# Altium schematic sheet MCU.SchDoc
size A4; SheetNumber: 2; SheetTotal: 4
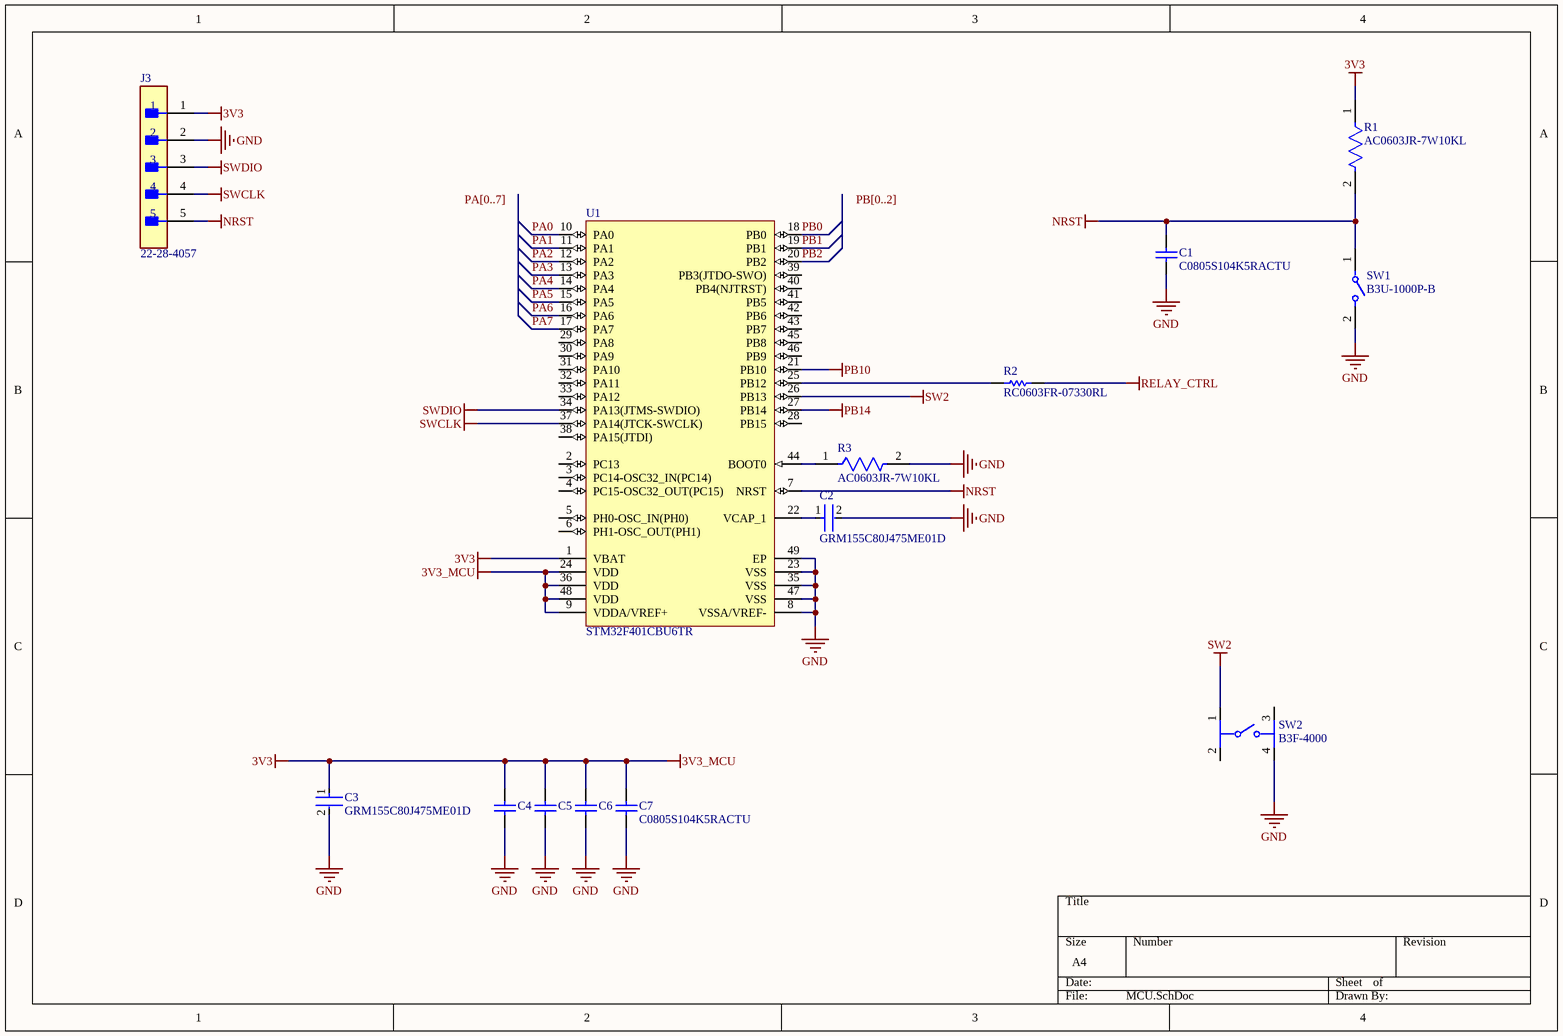
[diagram p0: MCU.SchDoc]

## Parts
C1  C0805S104K5RACTU  [CAPC2013X145X50NL20T25]
C2  GRM155C80J475ME01D  [FP-GRM155-0_2-MFG]
C3  GRM155C80J475ME01D  [FP-GRM155-0_2-MFG]
C4  C0805S104K5RACTU  [CAPC2013X145X50NL20T25]  (value not drawn)
C5  C0805S104K5RACTU  [CAPC2013X145X50NL20T25]  (value not drawn)
C6  C0805S104K5RACTU  [CAPC2013X145X50NL20T25]  (value not drawn)
C7  C0805S104K5RACTU  [CAPC2013X145X50NL20T25]
J3  22-28-4057  [FP-22-28-4057-MFG]
R1  AC0603JR-7W10KL  [FP-AC0603-IPC_A]
R2  RC0603FR-07330RL  [RESC1608X55X25NL10T15]
R3  AC0603JR-7W10KL  [FP-AC0603-IPC_A]
SW1  B3U-1000P-B  [FP-B3U-1000P-B-MFG]
SW2  B3F-4000  [FP-B3F-4000-MFG]
U1  STM32F401CBU6TR  [STM-UFQFPN48_L]

## Nets
3V3: C3.1 C4.2 C5.2 C6.2 C7.2 J3.1 R1.1 U1.1(VBAT) U1.9(VDDA/VREF+) U1.24(VDD) U1.36(VDD) U1.48(VDD)  [also labelled 3V3_MCU]
GND: C1.1 C2.2 C3.2 C4.1 C5.1 C6.1 C7.1 J3.2 R3.2 SW1.2 SW2.4 U1.8(VSSA/VREF-) U1.23(VSS) U1.35(VSS) U1.47(VSS) U1.49(EP)
NRST: C1.2 J3.5 R1.2 SW1.1 U1.7(NRST)
PB10: U1.21(PB10)
PB14: U1.27(PB14)
RELAY_CTRL: R2.2
SW2: SW2.1 U1.26(PB13)
SWCLK: J3.4 U1.37(PA14(JTCK-SWCLK))
SWDIO: J3.3 U1.34(PA13(JTMS-SWDIO))
PA0: U1.10(PA0)
PA1: U1.11(PA1)
PA2: U1.12(PA2)
PA3: U1.13(PA3)
PA4: U1.14(PA4)
PA5: U1.15(PA5)
PA6: U1.16(PA6)
PA7: U1.17(PA7)
PB0: U1.18(PB0)
PB1: U1.19(PB1)
PB2: U1.20(PB2)
NetC2_1: C2.1 U1.22(VCAP_1)
NetR2_1: R2.1 U1.25(PB12)
NetR3_1: R3.1 U1.44(BOOT0)

Not connected (* = marked no-connect by the designer): SW2 2 3; U1 2(PC13) 3(PC14-OSC32_IN(PC14)) 4(PC15-OSC32_OUT(PC15)) 5(PH0-OSC_IN(PH0)) 6(PH1-OSC_OUT(PH1)) 28(PB15) 29(PA8) 30(PA9) 31(PA10) 32(PA11) 33(PA12) 38(PA15(JTDI)) 39(PB3(JTDO-SWO)) 40(PB4(NJTRST)) 41(PB5) 42(PB6) 43(PB7) 45(PB8) 46(PB9)

## Buses and harness runs
bus PA[0..7]
bus PB[0..2]

## Notes on the sheet
- Labels drawn without touching a wire or pin: PA[0..7], PB[0..2]

## Library data of the parts
C1 C4-C7 = CMP-2007-01227-1: 100 nF 50 VDC X7R 10 % 0805; Manufacturer: Kemet; Part Number: C0805S104K5RACTU
C2 C3 = CMP-00260-151029462-1: 4.7 uF / GRM155C80J475ME01D; Voltage Rating (DC): 6.3V; Capacitance: 4.7µF; Dielectric: X6S; Length: 1mm; Case/Package: 0402; Width: 500µm; NexarPartId: 151029462; Thickness: 500µm
J3 = CMP-04776-001007-1: KK 100 HDR ASSY BKWY 05 CKT 30 S; Connector Type: Male Pin; Number of Contacts: 5; Glow Wire Compliant: Non-compliant; Gender: Male; Max Voltage Rating (DC): 250.25kV; Pitch: 2.54mm; Current Rating: 4A; Voltage Rating: 250V; Contact Resistance: 20mR; Min Operating Temperature: 0°C; Mount: Through Hole; Lead Free: Lead Free; Housing Color: Black; Max Operating Temperature: 75°C; Color: Black; Number of Rows: 1; Number of Circuits: 5; Contact Material: Brass; Packaging: Bulk; Contact Plating: Gold; Package Quantity: 1; Orientation: Straight; RoHS Compliant: Yes; Contact Type: Male Pin; Termination: Solder; Contact Mating Length: 0.32inch; Series: 42375; Number of Positions: 5; Housing Material: Thermoplastic
R1 R3 = CMP-03412-040683-1: RES 10kΩ 5.00% 0.2W 0603
R2 = CMP-1659-00020-2: Chip Resistor, 330 Ohm, +/- 1%, 0.1 W, -55 to 155 degC, 0603 (1608 Metric), RoHS, Tape and Reel; Tolerance: 10%; ESR: 800 mohm; Voltage Rating (DC): 16 V; Capacitance: 47 uF; Length: 7.3 mm; ComponentLink1URL: http://www.yageo.com/; Packaging: Tape and Reel; Pins: 2; ComponentLink1Description: Manufacturer URL; Case Code (Imperial): 2917; REACH SVHC: No SVHC; Width: 4.3 mm; ComponentLink2Description: Datasheet; Voltage Rating: 16 V; RoHSCompliant: True; Max Operating Temperature: 125degC; ComponentLink2URL: http://www.yageo.com/documents/recent/PYu-RC_Group_51_RoHS_L_04.pdf; Min Operating Temperature: -55degC; Case/Package: 2917; Radiation Hardening: No; DatasheetVersion: Rev. 4, 02/2016; Mount: Surface Mount; PackageReference: 0603; Package Quantity: 500; Case Code (Metric): 7343; PackageDescription: 2-Pin Surface Mount Device, Body 1.6 x 0.8 mm; Height: 3.1 mm
SW1 = CMP-08834-000005-1: SWITCH TACTILE SPST-NO 0.05A 12V; Manufacturer: Omron; Description: Tactile Switch SPST-NO Top Actuated Surface Mount; Operating Force: 1.5N; Contact Current Rating: 50mA; Contact Resistance: 100mΩ; Electromechanical Life: 200000Cycles; Height: 1.75mm; Device Class L2: Switches; Temperature Range High: +70°C; Digikey Description: SWITCH TACTILE SPST-NO 0.05A 12V; Throw Configuration: SPST-NO; Ambient Temperature Range High: +70°C; Temperature: -25°C to +70°C; Lead Free: Yes; ComponentLink2URL: https://omronfs.omron.com/en_US/ecb/products/pdf/en-b3u.pdf; Device Class L3: Tactile Switches; Manufacturer Part Number: B3U-1000P-B; Ambient Temperature Range Low: -25°C; Mount: Surface Mount; Automotive: No; Mouser Description: Tactile Switches Top Actuated with boss w/o ground; Octopart: https://octopart.com/b3u-1000p-b-omron-1057356; RoHS: TRUE; Package: 0; Device Class L1: Electromechanical; Voltage Rating Dc: 12V; Category: Switch; Temperature Range Low: -25°C; ComponentLink2Description: Datasheet
SW2 = CMP-08834-000001-1: SWITCH TACTILE SPST-NO 0.05A 24V; Manufacturer: Omron; Contact Current Rating: 50mA; Contact Resistance: 100mΩ; Operating Force: 1.27N; Electromechanical Life: 3000000Cycles; Digikey Description: SWITCH TACTILE SPST-NO 0.05A 24V; Automotive: No; Manufacturer Part Number: B3F-4000; Temperature Range High: +70°C; Octopart: https://octopart.com/b3f-4000-omron-22510; Mouser Description: Tactile Switches 12x12mm Std Ht 4.3 Gen Purpose 130g; Throw Configuration: SPST-NO; Height: 4.5mm; Voltage Rating Dc: 24V; Temperature: -25°C to +70°C; Device Class L1: Electromechanical; Device Class L2: Switches; Ambient Temperature Range Low: -25°C; Category: Switch; Mount: Through Hole; Device Class L3: Tactile Switches; RoHS: TRUE; ComponentLink2Description: Datasheet; Temperature Range Low: -25°C; Ambient Temperature Range High: +70°C; ComponentLink2URL: https://omronfs.omron.com/en_US/ecb/products/pdf/en-b3f.pdf; Package: B3F-4000; Lead Free: Yes
U1 = CMP-0243-00136-1: ARM Cortex-M4 32-bit MCU+FPU, 128 KB Flash, 64 KB Internal RAM, 36 I/Os, 48-Pin UFQFPN, -40 to 85 degC, Tape and Reel; Internal RAM Size (kB): 64; FLASH Size (Prog) (kB): 128; Operating Frequency(F) (Processor speed) (MHz): 84; I/Os (High Current): 36; Supply Voltage(Vcc) min (V): 1.7; Package Reference: 48-Pin Ultra Thin Fine Pitch Quad Flat No-Lead, 7 x 7 x 0.6 mm Body, 0.5 mm Pitch, Exposed Pad; Package Description: UFQFPN48; ComponentLink1Description: Manufacturer URL; ComponentLink2URL: http://www.st.com/st-web-ui/static/active/en/resource/technical/document/datasheet/DM00086815.pdf; ComponentLink2Description: Datasheet; ComponentLink1URL: http://www.st.com/; Mounting Technology: Surface Mount; Packing: Tape and Reel; Core: ARM Cortex-M4; DatasheetVersion: Rev. 5